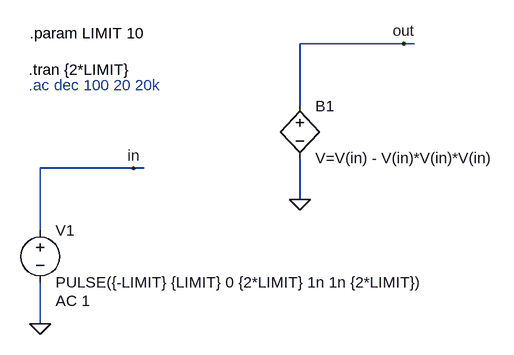
[diagram p0: schematic cubic-linear.asc]
cubic-linear.asc, the LTspice schematic file:
Version 4
SHEET 1 916 680
WIRE 464 -192 304 -192
WIRE 480 -192 464 -192
WIRE 304 -96 304 -192
WIRE 48 0 -96 0
WIRE 64 0 48 0
WIRE 304 48 304 -16
WIRE -96 96 -96 0
WIRE -96 240 -96 176
FLAG -96 240 0
FLAG 48 0 in
FLAG 304 48 0
FLAG 464 -192 out
SYMBOL External\\voltage -96 80 R0
WINDOW 123 24 124 Left 2
WINDOW 39 0 0 Left 0
SYMATTR InstName V1
SYMATTR Value PULSE({-LIMIT} {LIMIT} 0 {2*LIMIT} 1n 1n {2*LIMIT})
SYMATTR Value2 AC 1
SYMBOL bv 304 -112 R0
SYMATTR InstName B1
SYMATTR Value V=V(in) - V(in)*V(in)*V(in)
TEXT -114 -152 Left 2 !.tran {2*LIMIT}
TEXT -112 -208 Left 2 !.param LIMIT 10
TEXT -114 -128 Left 2 ;.ac dec 100 20 20k

The netlist it stands for:
* cubic-linear.asc
V1 in 0 PULSE({-LIMIT} {LIMIT} 0 {2*LIMIT} 1n 1n {2*LIMIT}) AC 1
B1 out 0 V=V(in) - V(in)*V(in)*V(in)
.tran {2*LIMIT}
.param LIMIT 10
* .ac dec 100 20 20k
.backanno
.end